# EAGLE design EbowPlaca (EAGLE 6.4)
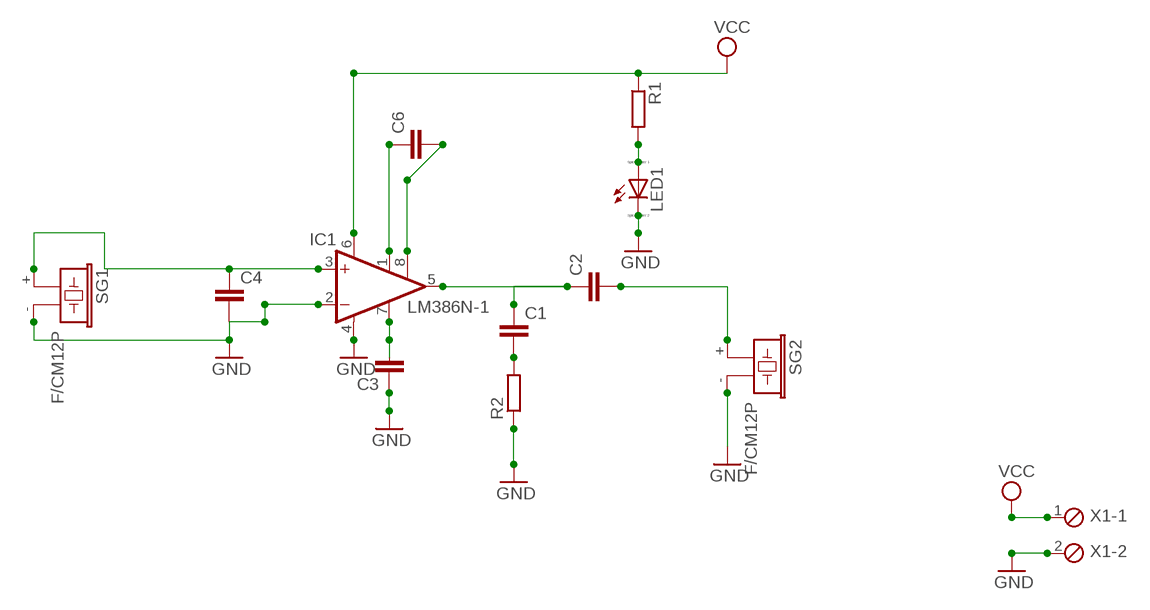
[diagram p0: schematic, sheet 1]

## Parts
C1  C5/3  [C5B3]
C2  C5/2.5  [C5B2.5]
C3  C2.5/5  [C2.5-5]
C4  C2.5/4  [C2.5-4]
C6  C5/3  [C5B3]
IC1  LM386N-1  [DIL08]
LED1  LED_ELD260  [LED_LD260]
R1  R-EU_0207/10  [0207/10]
R2  R-EU_0207/10  [0207/10]
SG1  F/CM12P  [F/CM12P]
SG2  F/CM12P  [F/CM12P]
X1  MPT2  [2POL254]

## Nets
GND: C3.1 C4.2 IC1.2(-IN) IC1.4(GND) LED1.K(C) R2.1 SG1.- SG2.- X1.2
N$1: C1.2 R2.2
N$2: LED1.A R1.2
N$4: C6.1 IC1.1(GAIN)
N$5: C6.2 IC1.8(GAIN)
N$6: C1.1 C2.1 IC1.5(OUT)
N$7: C4.1 IC1.3(+IN) SG1.+
N$9: C3.2 IC1.7(BYPASS)
N$10: C2.2 SG2.+
VCC: IC1.6(VS) R1.1 X1.1

## Library data of the parts
C1-C4 C6 = capacitor-wima:C: CAPACITOR naming: grid - package width
IC1 = linear:LM386?-*: Low Voltage Audio Power Amplifier Source: http://cache.national.com/ds/LM/LM386.pdf
LED1 = eagle-ltspice:LED_E: LED Source: http://www.osram.convergy.de Source: www.luxeon.com Source: www.kingbright.com; SPICEMODEL: NONE; SPICEPREFIX: D; SPICETYPE: diode
R1 R2 = resistor:R-EU_: RESISTOR, European symbol
SG1 SG2 = buzzer:F/CM12P: BUZZER Source: Buerklin; OC_FARNELL: unknown; OC_NEWARK: unknown
X1 = con-phoenix-254:MPT2: PHOENIX CONNECTOR; OC_FARNELL: unknown; OC_NEWARK: unknown

## Board
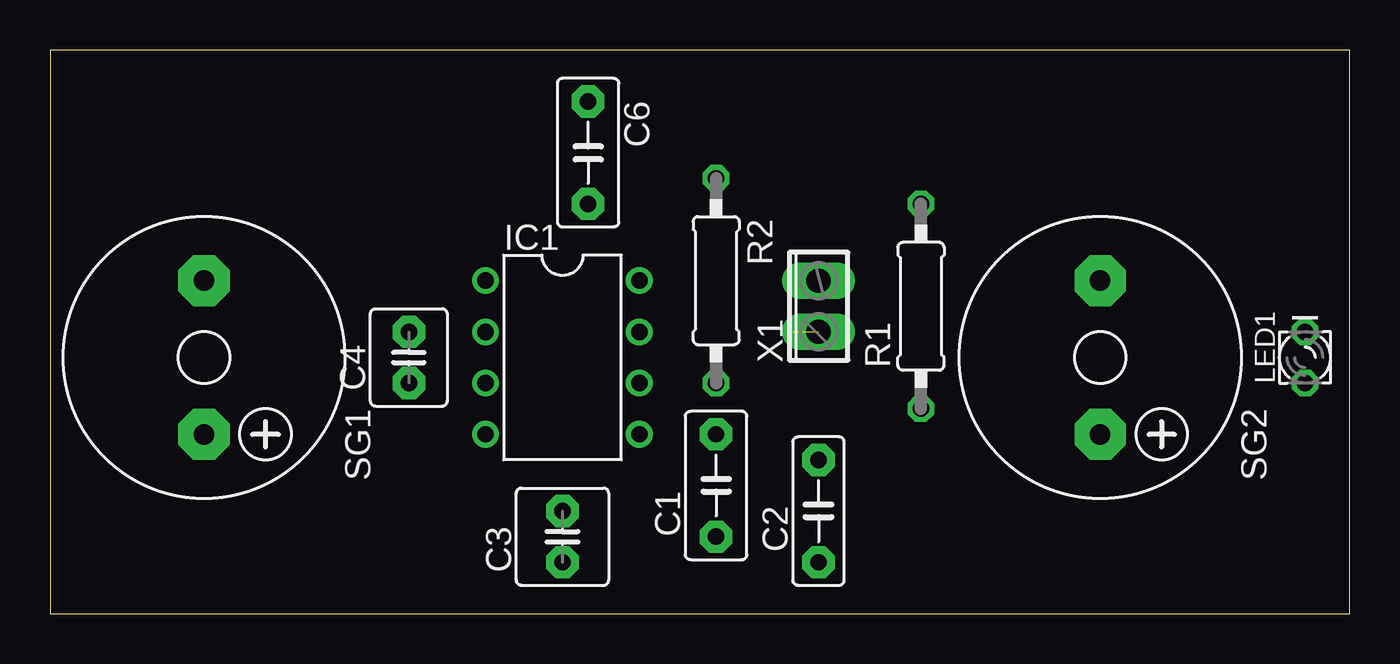
[diagram p1: board, top side]
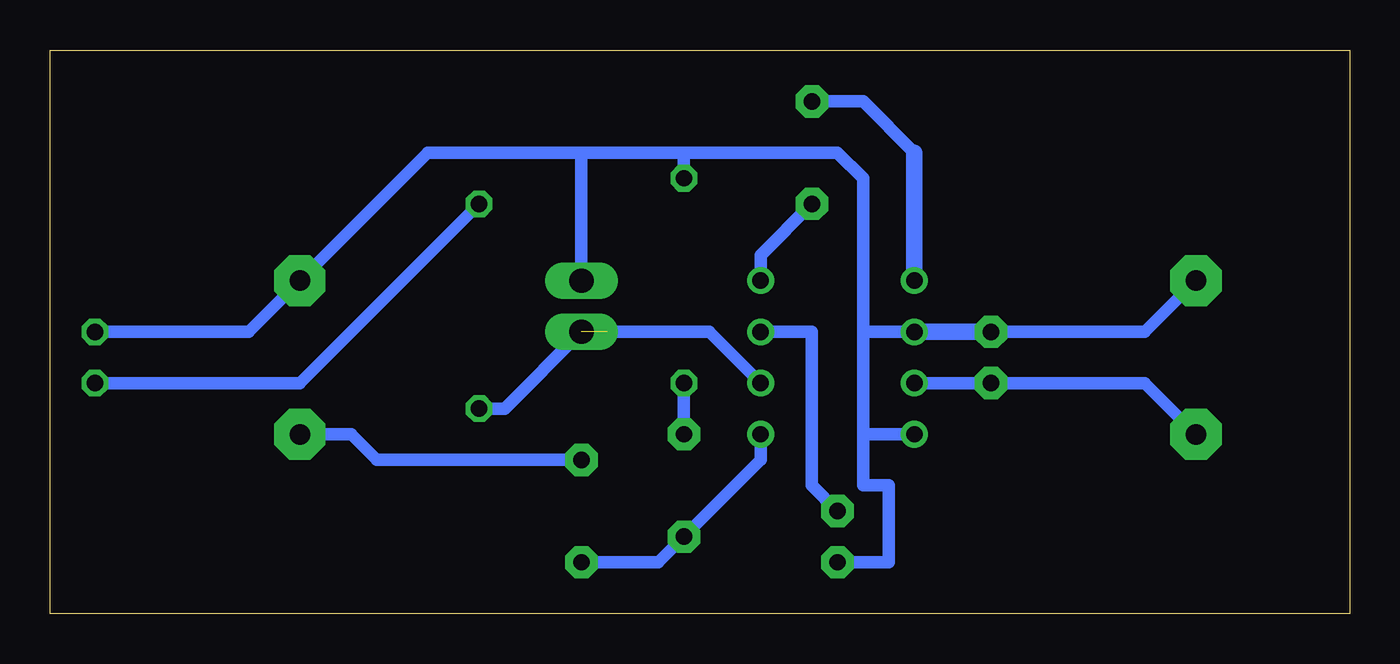
[diagram p2: board, bottom side, seen from below]

Size 64.44 x 27.93 mm. Coordinates in mm from the lower left corner, seen from the top.
Outline: 0,0 64.44,0 64.44,27.93 0,27.93 0,0
Copper layers (1*16): Top 0.035mm / dielectric 1.5mm / Bottom 0.035mm
Design rules "default": minimum track width 10mil, minimum drill 24mil, track to track 8mil, track to pad 8mil, pad to pad 8mil, via to via 8mil, smd to smd 8mil, copper to edge 40mil, drill to drill 8mil, minimum pad ring 10mil, minimum via ring 8mil, stop-mask expansion 4mil, vias tented up to drill 0mil, thermal gap 10mil

### Footprints (pad centres in the part's own frame; a part is rotated, then mirrored left to right if it is on the bottom)
C5B3 = drill 0.813 pad 1.6 octagon: 1 -2.54,0; 2 2.54,0
C5B2.5 = drill 0.813 pad 1.6 octagon: 1 -2.54,0; 2 2.54,0
C2.5-5 = drill 0.813 pad 1.6 octagon: 1 -1.27,0; 2 1.27,0
C2.5-4 = drill 0.813 pad 1.6 octagon: 1 -1.27,0; 2 1.27,0
DIL08 = drill 0.813 pad 1.27: 1 -3.81,-3.81; 2 -1.27,-3.81; 3 1.27,-3.81; 4 3.81,-3.81; 5 3.81,3.81; 6 1.27,3.81; 7 -1.27,3.81; 8 -3.81,3.81
LED_LD260 = drill 0.813 octagon: A -1.27,0; K 1.27,0
0207/10 = drill 0.813 octagon: 1 -5.08,0; 2 5.08,0
F/CM12P = drill 1.016 pad 2.54 octagon: + 3.81,0; - -3.81,0
2POL254 = drill 1.2 long: 1 -1.27,0; 2 1.27,0

### Placement (x,y rotation side)
C1  33.02,6.35 90 top
C2  38.1,5.08 90 top
C3  25.4,3.81 90 top
C4  17.78,12.7 90 top
C6  26.67,22.86 270 top
IC1  25.4,12.7 270 top
LED1  62.23,12.7 90 top
R1  43.18,15.24 90 top
R2  33.02,16.51 270 top
SG1  7.62,12.7 270 top
SG2  52.07,12.7 270 top
X1  38.1,15.24 90 top

### Tracks (layer width: path | path; a pad name or v marks a point on that pad's centre or on a via)
GND
  Bottom 0.61: 33.02,22.86 25.4,22.86 24.13,21.59 24.13,13.97 | 24.13,13.97 24.13,8.89 | 24.13,8.89 24.13,6.35 22.86,6.35 22.86,2.54 C3.1 | IC1.2 24.13,13.97 | IC1.4 24.13,8.89 | SG1.- 10.16,13.97 C4.2 | R2.1 33.02,22.86 | X1.2 38.1,22.86 | 38.1,22.86 33.02,22.86 | 38.1,22.86 45.72,22.86 SG2.- 54.61,13.97 LED1.K
  Bottom 0.813: C4.2 IC1.2
N$1
  Bottom 0.61: C1.2 R2.2
N$2
  Bottom 0.61: R1.2 52.07,11.43 LED1.A
N$4
  Bottom 0.61: C6.1 24.13,25.4 21.59,22.86
  Bottom 0.813: IC1.1 21.59,22.86
N$5
  Bottom 0.61: C6.2 29.21,17.78 IC1.8
N$6
  Bottom 0.61: C2.1 34.29,2.54 C1.1 29.21,7.62 IC1.5
N$7
  Bottom 0.61: SG1.+ 10.16,11.43 C4.1 IC1.3
N$9
  Bottom 0.61: C3.2 26.67,6.35 26.67,13.97 IC1.7
N$10
  Bottom 0.61: C2.2 48.26,7.62 49.53,8.89 SG2.+
VCC  (1 unrouted)
  Bottom 0.61: X1.1 41.91,10.16 R1.1 | IC1.6 31.75,13.97 36.83,13.97